# Altium schematic sheet C-03 eMMC_NAND_TF_QSPI.SchDoc
size 513 x 386 mm
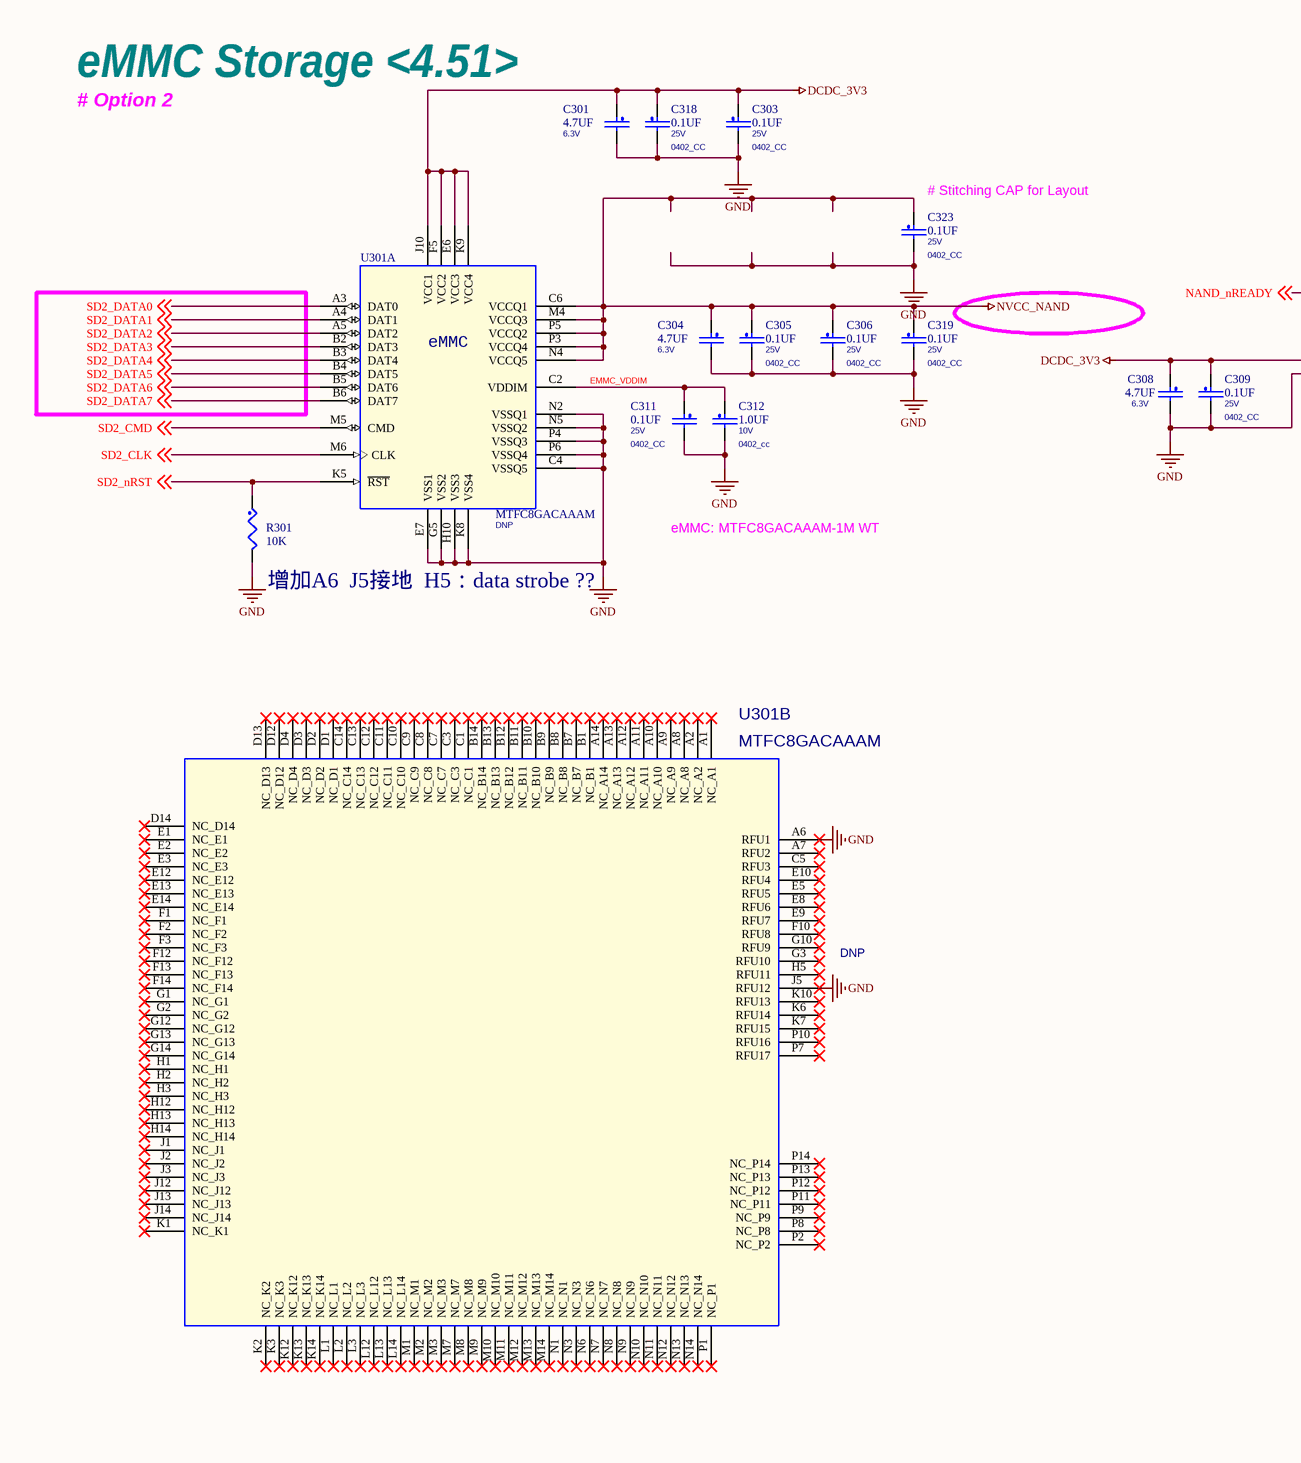
[diagram p0: C-03 eMMC_NAND_TF_QSPI.SchDoc, left]
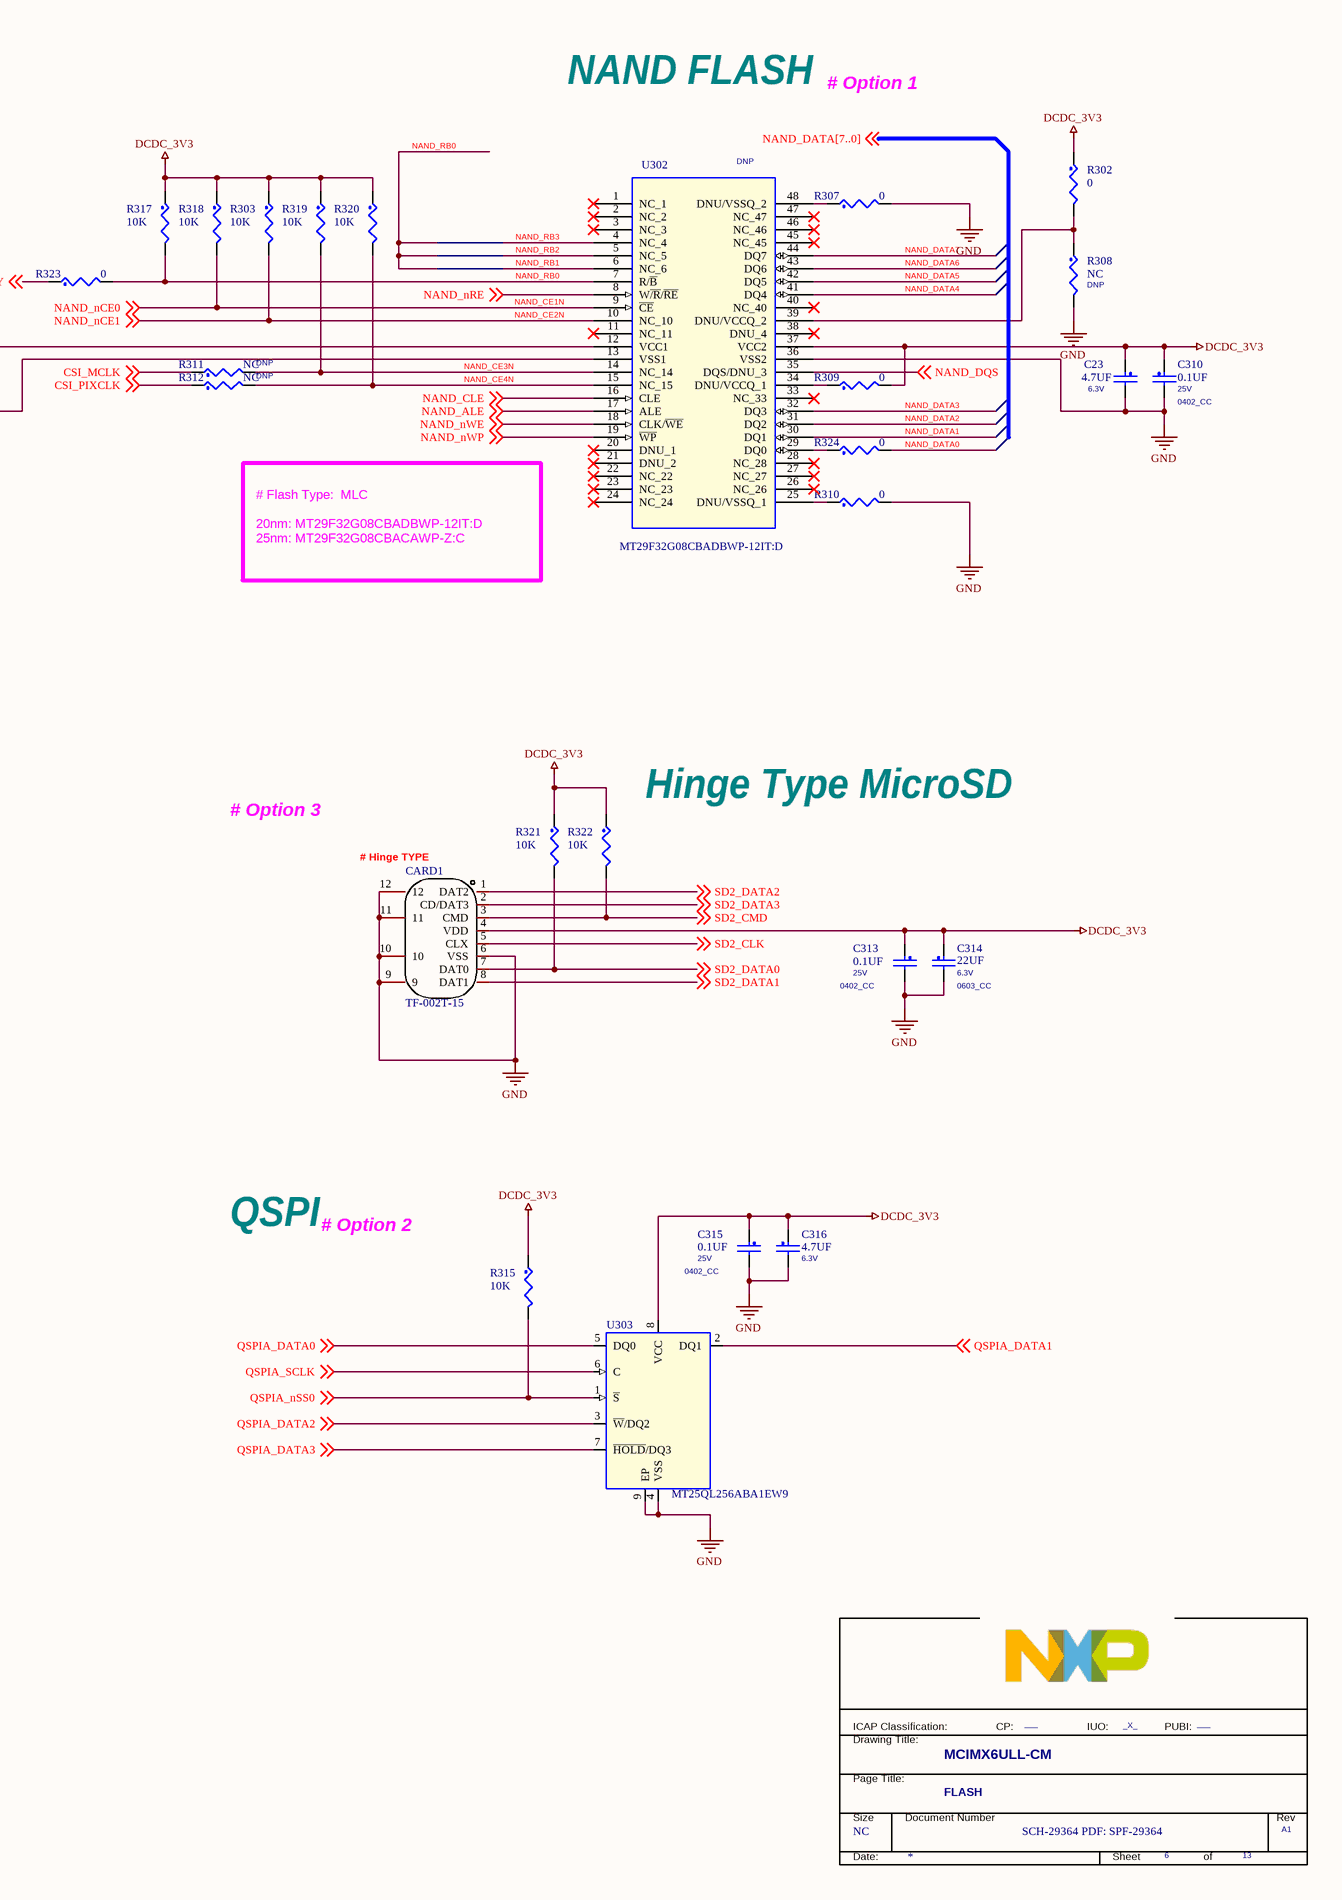
[diagram p1: C-03 eMMC_NAND_TF_QSPI.SchDoc, right]

## Parts
*  PageTitle: FLASH  Page Count: 13  Page Number: 6  Page Size: NC  Title: MCIMX6ULL-CM  RevCode: A1  Doc: SCH-29364 PDF: SPF-29364  FCP: ___  FIUO: _X_  (hidden comment: TitleBlock_FS)  (graphical)
C23  4.7UF  voltage rating: 6.3V  [0402T_C]
C301  4.7UF  voltage rating: 6.3V  [0402T_C]
C303  0.1UF  VOLTAGE: 25V  PCB Footprint: 0402_CC  [0402T_C]
C304  4.7UF  voltage rating: 6.3V  [0402T_C]
C305  0.1UF  VOLTAGE: 25V  PCB Footprint: 0402_CC  [0402T_C]
C306  0.1UF  VOLTAGE: 25V  PCB Footprint: 0402_CC  [0402T_C]
C308  4.7UF  voltage rating: 6.3V  [0402T_C]
C309  0.1UF  VOLTAGE: 25V  PCB Footprint: 0402_CC  [0402T_C]
C310  0.1UF  VOLTAGE: 25V  PCB Footprint: 0402_CC  [0402T_C]
C311  0.1UF  VOLTAGE: 25V  PCB Footprint: 0402_CC  [0402T_C]
C312  1.0UF  VOLTAGE: 10V  PCB Footprint: 0402_cc  [0402T_C]
C313  0.1UF  VOLTAGE: 25V  PCB Footprint: 0402_CC  [0402T_C]
C314  22UF  voltage rating: 6.3V  [0603_CC]
C315  0.1UF  VOLTAGE: 25V  PCB Footprint: 0402_CC  [0402T_C]
C316  4.7UF  voltage rating: 6.3V  [0402T_C]
C318  0.1UF  VOLTAGE: 25V  PCB Footprint: 0402_CC  [0402T_C]
C319  0.1UF  VOLTAGE: 25V  PCB Footprint: 0402_CC  [0402T_C]
C323  0.1UF  VOLTAGE: 25V  PCB Footprint: 0402_CC  [0402T_C]
CARD1  TF-002T-15  [TF-SMD_TF-002T-15]
R301  10K  [0402T_C]
R302  0  [0402T_C]
R303  10K  [0402T_C]
R307  0  [0402T_C]
R308  NC  ASSY_OPT: DNP  [0402T_C]
R309  0  [0402T_C]
R310  0  [0402T_C]
R311  NC  ASSY_OPT: DNP  [0402T_C]
R312  NC  ASSY_OPT: DNP  [0402T_C]
R315  10K  [0402T_C]
R317  10K  [0402T_C]
R318  10K  [0402T_C]
R319  10K  [0402T_C]
R320  10K  [0402T_C]
R321  10K  [0402T_C]
R322  10K  [0402T_C]
R323  0  [0402T_C]
R324  0  [0402T_C]
U301  MTFC8GACAAAM  ASSY_OPT: DNP  [FBGA153_0P5_11P5X13]  (parts A,B of 2)
U302  MT29F32G08CBADBWP-12IT:D  ASSY_OPT: DNP  [tsop48_12x20]
U303  MT25QL256ABA1EW9  [mlp8_1p27_8x6]

## Nets
DCDC_3V3: C23.1 C301.1 C303.1 C308.1 C309.1 C310.1 C313.1 C314.1 C315.1 C316.1 C318.1 CARD1.4(VDD) R302.1 R303.1 R309.2 R315.1 R317.1 R318.1 R319.1 R320.1 R321.1 R322.1 U301.E6(VCC3) U301.F5(VCC2) U301.J10(VCC1) U301.K9(VCC4) U302.12(VCC1) U302.37(VCC2) U303.8(VCC)
GND: C23.2 C301.2 C303.2 C304.2 C305.2 C306.2 C308.2 C309.2 C310.2 C311.2 C312.2 C313.2 C314.2 C315.2 C316.2 C318.2 C319.2 C323.2 CARD1.6(VSS) CARD1.9 CARD1.10 CARD1.11 CARD1.12 R301.2 R307.2 R308.2 R310.2 U301.A6(RFU1) U301.C4(VSSQ5) U301.E7(VSS1) U301.G5(VSS2) U301.H10(VSS3) U301.J5(RFU12) U301.K8(VSS4) U301.N2(VSSQ1) U301.N5(VSSQ2) U301.P4(VSSQ3) U301.P6(VSSQ4) U302.13(VSS1) U302.36(VSS2) U303.4(VSS) U303.9(EP)
NVCC_NAND: C304.1 C305.1 C306.1 C319.1 C323.1 U301.C6(VCCQ1) U301.M4(VCCQ3) U301.N4(VCCQ5) U301.P3(VCCQ4) U301.P5(VCCQ2)
CSI_MCLK: R311.1 ; off-sheet CSI_MCLK
CSI_PIXCLK: R312.1 ; off-sheet CSI_PIXCLK
EMMC_VDDIM: C311.1 C312.1 U301.C2(VDDIM)
NAND_ALE: U302.17(ALE) ; off-sheet NAND_ALE
NAND_CE1N: R318.2 U302.9(~{CE}) ; off-sheet NAND_nCE0  [also labelled NAND_nCE0]
NAND_CE2N: R303.2 U302.10(NC_10) ; off-sheet NAND_nCE1  [also labelled NAND_nCE1]
NAND_CE3N: R311.2 R319.2 U302.14(NC_14)
NAND_CE4N: R312.2 R320.2 U302.15(NC_15)
NAND_CLE: U302.16(CLE) ; off-sheet NAND_CLE
NAND_DATA0: R324.2
NAND_DATA1: U302.30(DQ1)
NAND_DATA2: U302.31(DQ2)
NAND_DATA3: U302.32(DQ3)
NAND_DATA4: U302.41(DQ4)
NAND_DATA5: U302.42(DQ5)
NAND_DATA6: U302.43(DQ6)
NAND_DATA7: U302.44(DQ7)
NAND_DQS: U302.35(DQS/DNU_3) ; off-sheet NAND_DQS
NAND_nRE: U302.8(W~{/R}/~{RE}) ; off-sheet NAND_nRE
NAND_nREADY: R323.1 ; off-sheet NAND_nREADY
NAND_nWE: U302.18(CLK/~{WE}) ; off-sheet NAND_nWE
NAND_nWP: U302.19(~{WP}) ; off-sheet NAND_nWP
NAND_RB0: R317.2 R323.2 U302.4(NC_4) U302.5(NC_5) U302.6(NC_6) U302.7(R/~{B})  [also labelled NAND_RB1, NAND_RB2, NAND_RB3]
QSPIA_DATA0: U303.5(DQ0) ; off-sheet QSPIA_DATA0
QSPIA_DATA1: U303.2(DQ1) ; off-sheet QSPIA_DATA1
QSPIA_DATA2: U303.3(~{W}/DQ2) ; off-sheet QSPIA_DATA2
QSPIA_DATA3: U303.7(~{HOLD}/DQ3) ; off-sheet QSPIA_DATA3
QSPIA_nSS0: R315.2 U303.1(~{S}) ; off-sheet QSPIA_nSS0
QSPIA_SCLK: U303.6(C) ; off-sheet QSPIA_SCLK
SD2_CLK: CARD1.5(CLX) U301.M6(CLK) ; off-sheet SD2_CLK
SD2_CMD: CARD1.3(CMD) R322.2 U301.M5(CMD) ; off-sheet SD2_CMD
SD2_DATA0: CARD1.7(DAT0) R321.2 U301.A3(DAT0) ; off-sheet SD2_DATA0
SD2_DATA1: CARD1.8(DAT1) U301.A4(DAT1) ; off-sheet SD2_DATA1
SD2_DATA2: CARD1.1(DAT2) U301.A5(DAT2) ; off-sheet SD2_DATA2
SD2_DATA3: CARD1.2(CD/DAT3) U301.B2(DAT3) ; off-sheet SD2_DATA3
SD2_DATA4: U301.B3(DAT4) ; off-sheet SD2_DATA4
SD2_DATA5: U301.B4(DAT5) ; off-sheet SD2_DATA5
SD2_DATA6: U301.B5(DAT6) ; off-sheet SD2_DATA6
SD2_DATA7: U301.B6(DAT7) ; off-sheet SD2_DATA7
SD2_nRST: R301.1 U301.K5(~{RST}) ; off-sheet SD2_nRST
NetR302_2: R302.2 R308.1 U302.39(DNU/VCCQ_2)
NetR307_1: R307.1 U302.48(DNU/VSSQ_2)
NetR309_1: R309.1 U302.34(DNU/VCCQ_1)
NetR310_1: R310.1 U302.25(DNU/VSSQ_1)
NetR324_1: R324.1 U302.29(DQ0)

Not connected (* = marked no-connect by the designer): U301 A1(NC_A1)* A2(NC_A2)* A7(RFU2)* A8(NC_A8)* A9(NC_A9)* A10(NC_A10)* A11(NC_A11)* A12(NC_A12)* A13(NC_A13)* A14(NC_A14)* B1(NC_B1)* B7(NC_B7)* B8(NC_B8)* B9(NC_B9)* B10(NC_B10)* B11(NC_B11)* B12(NC_B12)* B13(NC_B13)* B14(NC_B14)* C1(NC_C1)* C3(NC_C3)* C5(RFU3)* C7(NC_C7)* C8(NC_C8)* C9(NC_C9)* C10(NC_C10)* C11(NC_C11)* C12(NC_C12)* C13(NC_C13)* C14(NC_C14)* D1(NC_D1)* D2(NC_D2)* D3(NC_D3)* D4(NC_D4)* D12(NC_D12)* D13(NC_D13)* D14(NC_D14)* E1(NC_E1)* E2(NC_E2)* E3(NC_E3)* E5(RFU5)* E8(RFU6)* E9(RFU7)* E10(RFU4)* E12(NC_E12)* E13(NC_E13)* E14(NC_E14)* F1(NC_F1)* F2(NC_F2)* F3(NC_F3)* F10(RFU8)* F12(NC_F12)* F13(NC_F13)* F14(NC_F14)* G1(NC_G1)* G2(NC_G2)* G3(RFU10)* G10(RFU9)* G12(NC_G12)* G13(NC_G13)* G14(NC_G14)* H1(NC_H1)* H2(NC_H2)* H3(NC_H3)* H5(RFU11)* H12(NC_H12)* H13(NC_H13)* H14(NC_H14)* J1(NC_J1)* J2(NC_J2)* J3(NC_J3)* J12(NC_J12)* J13(NC_J13)* J14(NC_J14)* K1(NC_K1)* K2(NC_K2)* K3(NC_K3)* K6(RFU14)* K7(RFU15)* K10(RFU13)* K12(NC_K12)* K13(NC_K13)* K14(NC_K14)* L1(NC_L1)* L2(NC_L2)* L3(NC_L3)* L12(NC_L12)* L13(NC_L13)* L14(NC_L14)* M1(NC_M1)* M2(NC_M2)* M3(NC_M3)* M7(NC_M7)* M8(NC_M8)* M9(NC_M9)* M10(NC_M10)* M11(NC_M11)* M12(NC_M12)* M13(NC_M13)* M14(NC_M14)* N1(NC_N1)* N3(NC_N3)* N6(NC_N6)* N7(NC_N7)* N8(NC_N8)* N9(NC_N9)* N10(NC_N10)* N11(NC_N11)* N12(NC_N12)* N13(NC_N13)* N14(NC_N14)* P1(NC_P1)* P2(NC_P2)* P7(RFU17)* P8(NC_P8)* P9(NC_P9)* P10(RFU16)* P11(NC_P11)* P12(NC_P12)* P13(NC_P13)* P14(NC_P14)*; U302 1(NC_1)* 2(NC_2)* 3(NC_3)* 11(NC_11)* 20(DNU_1)* 21(DNU_2)* 22(NC_22)* 23(NC_23)* 24(NC_24)* 26(NC_26)* 27(NC_27)* 28(NC_28)* 33(NC_33)* 38(DNU_4)* 40(NC_40)* 45(NC_45)* 46(NC_46)* 47(NC_47)*

## Notes on the sheet
- eMMC Storage <4.51>
- # Option 2
- NAND FLASH
- # Option 1
- (near C323) # Stitching CAP for Layout
- eMMC: MTFC8GACAAAM-1M WT
- # Flash Type:  MLC
- 20nm: MT29F32G08CBADBWP-12IT:D
  25nm: MT29F32G08CBACAWP-Z:C
- (near R301) 增加A6  J5接地  H5：data strobe ??
- # Option 3
- (near CARD1) # Hinge TYPE
- (near R322) Hinge Type MicroSD
- QSPI
- (in symbol MTFC4GMVEA_WFBGA_153P, part A) eMMC
- (in symbol TitleBlock_FS) ICAP Classification:; CP:; IUO:; PUBI:; Drawing Title:; Page Title:; Size; Document Number; Rev; Date:; Sheet; of

## Library data of the parts
* = TitleBlock_FS: OrgAddr2: Austin, TX 78735-8598; OrgAddr1: 6501 William Cannon Drive West; OrgName: Freescale Semiconductor; Page Create Date: March  8, 1995; PUBI: ___; Page Modify Date: *
C23 C301 C308 C316 = CAP_NP: CAP CER 4.7UF 6.3V 20% X5R 0402; CLASS: DISCRETE; FPLIST: CC0402_25,CC0402_HD,0402_CC; CAD_APPROVED: Yes; MFG_PN01: C1005X5R0J475M050BC; MFG_NAME01: TDK; AGILE_PN: 150-78463; PCB Footprint: 0402_CC; HEIGHT: 0.65MM; ROHS: Yes; Tolerance: 20%; VOLTAGE: 6.3V
C303 C310 C319 = CAP_NP: CAP CER 0.1UF 25V 10% X5R 0402; CLASS: DISCRETE; FPLIST: CC0402_25,CC0402_HD,0402_CC; CAD_APPROVED: Yes; MFG_PN01: CC0402KRX5R8BB104; MFG_NAME01: YAGEO AMERICA; AGILE_PN: 150-78633; HEIGHT: 0.55MM; ROHS: Yes; Tolerance: 10%
C304 = CAP_NP: CAP CER 4.7UF 6.3V 20% X5R 0402; CLASS: DISCRETE; AGILE_PN: 150-78463; MFG_NAME01: TDK; MFG_PN01: C1005X5R0J475M050BC; CAD_APPROVED: Yes; FPLIST: CC0402_25,CC0402_HD,0402_CC; PCB Footprint: 0402_CC; VOLTAGE: 6.3V; Tolerance: 20%; ROHS: Yes; HEIGHT: 0.65MM
C305 C306 C309 C311 C313 C315 C318 C323 = CAP_NP: CAP CER 0.1UF 25V 10% X5R 0402; CLASS: DISCRETE; AGILE_PN: 150-78633; MFG_NAME01: YAGEO AMERICA; MFG_PN01: CC0402KRX5R8BB104; CAD_APPROVED: Yes; FPLIST: CC0402_25,CC0402_HD,0402_CC; Tolerance: 10%; ROHS: Yes; HEIGHT: 0.55MM
C312 = CAP_NP: CAP CER 1.0UF 10V 10% X5R 0402; CLASS: DISCRETE; AGILE_PN: 150-75772; MFG_NAME01: YAGEO AMERICA; MFG_PN01: CC0402KRX5R6BB105; CAD_APPROVED: Yes; FPLIST: CC0402_25,CC0402_HD,0402_CC; ROHS: Yes; HEIGHT: 0.6MM
C314 = CAP_NP: CAP CER 22UF 6.3V 20% X5R 0603; CLASS: DISCRETE; AGILE_PN: 150-78467; MFG_NAME01: Samsung; MFG_PN01: CL10A226MQ8NRNE; CAD_APPROVED: Yes; FPLIST: CC0603_OV,CC0603,0603_CC; Tolerance: 20%; ROHS: Yes; HEIGHT: 1MM; VOLTAGE: 6.3V; PCB Footprint: 0603_CC
CARD1 = TF-002T-15: 卡连接方式:翻盖式;卡类型:MicroSD卡(TF卡);连接器类型:卡座;本体最大高度:-;触头材质:-;触头镀层:-;工作温度范围:-;焊接温度(最大值):-;; Manufacturer: SOFNG(硕方); Add into BOM: yes; Card Connection Mode: 翻盖式; Connector Type: 卡座; Name: TF-002T-15; Symbol: TF-002T-15; Device: TF-002T-15; LCSC Part Name: 翻盖式 MicroSD卡(TF卡) 卡座; Supplier Part: C125616; Manufacturer Part: TF-002T-15; Supplier Footprint: SMD; JLCPCB Part Class: Extended Part; Datasheet: https://atta.szlcsc.com/upload/public/pdf/source/20171030/C125616_15093664954201068197.pdf; Supplier: LCSC; Convert to PCB: yes; Card Type: MicroSD卡(TF卡); Maximum Body Height: -; Contact Material: -; Contact Plating: -; Operating Temperature Range: -; Welding Temperature (Max): -
R301 R303 R315 R318 R319 R321 = RES: RES MF 10K 1/16W 5% 0402; CLASS: DISCRETE; AGILE_PN: 470-75557; MFG_NAME01: VISHAY INTERTECHNOLOGY; MFG_PN01: CRCW040210K0JNED; CAD_APPROVED: Yes; FPLIST: RC0402_25,RC0402_HD,0402_CC; PCB Footprint: 0402_CC; HEIGHT: 0.4 MM; Tolerance: 5%; ROHS: Yes
  R301: TOL: 5%
R302 R308 R311 R324 = RES: RES MF ZERO OHM 1/16W 5% 0402; CLASS: DISCRETE; AGILE_PN: 470-75394; MFG_NAME01: ROHM; MFG_PN01: MCR01MZPJ000; CAD_APPROVED: Yes; FPLIST: RC0402_25,RC0402_HD,RC0402_X2,0402_CC; PCB Footprint: 0402_CC; HEIGHT: 0.45 MM; Tolerance: 5%; ROHS: Yes
R307 R309 R310 R312 R323 = RES: RES MF ZERO OHM 1/16W 5% 0402; CLASS: DISCRETE; FPLIST: RC0402_25,RC0402_HD,RC0402_X2,0402_CC; CAD_APPROVED: Yes; MFG_PN01: MCR01MZPJ000; MFG_NAME01: ROHM; AGILE_PN: 470-75394; PCB Footprint: 0402_CC; HEIGHT: 0.45 MM; ROHS: Yes; Tolerance: 5%
R317 R320 R322 = RES: RES MF 10K 1/16W 5% 0402; CLASS: DISCRETE; FPLIST: RC0402_25,RC0402_HD,0402_CC; CAD_APPROVED: Yes; MFG_PN01: CRCW040210K0JNED; MFG_NAME01: VISHAY INTERTECHNOLOGY; AGILE_PN: 470-75557; PCB Footprint: 0402_CC; HEIGHT: 0.4 MM; ROHS: Yes; Tolerance: 5%
U301 = MTFC4GMVEA_WFBGA_153P: IC MEM NAND FLASH 8GB MMC 4.51 CTLR 2.7-3.6V FBGA153; CAD_APPROVED: Yes; MFG_PN01: MTFC8GACAAAM-1M WT; MFG_NAME01: MICRON; AGILE_PN: 342-00603; CLASS: IC; HEIGHT: 1.165 MM; ROHS: Yes; PCB Footprint: FBGA153_0P5_11P5X13
U302 = MT29F32G08CBADB_48P: IC MEM NAND FLASH ASYNC 32GB 2.7-3.6V TSOP48; CAD_APPROVED: Yes; MFG_NAME01: Micron; AGILE_PN: 334-77617; CLASS: IC; HEIGHT: 1.2 MM; ROHS: Yes; MFG_PN01: MT29F32G08CBADBWP-12IT:D; PCB Footprint: tsop48_12x20
U303 = MT25QL256ABA1EW9_9P: IC MEM FLASH SERIAL NOR 256MBIT 2.7-3.6V MLP8; AGILE_PN: 334-77609; MFG_NAME01: Micron; MFG_PN01: MT25QL256ABA1EW9-0SIT; CAD_APPROVED: Yes; CLASS: IC; PCB Footprint: mlp8_1p27_8x6; ROHS: Yes; HEIGHT: 0.8MM